# EasyEDA schematic SCH_LED-CIRCUIT_2025-07-21.json
TITLE: Sheet_1; REV: 1.0; Date: 2025-07-01; Sheet: 1/1; Drawn By: mirriamatim23; Company: Your Company
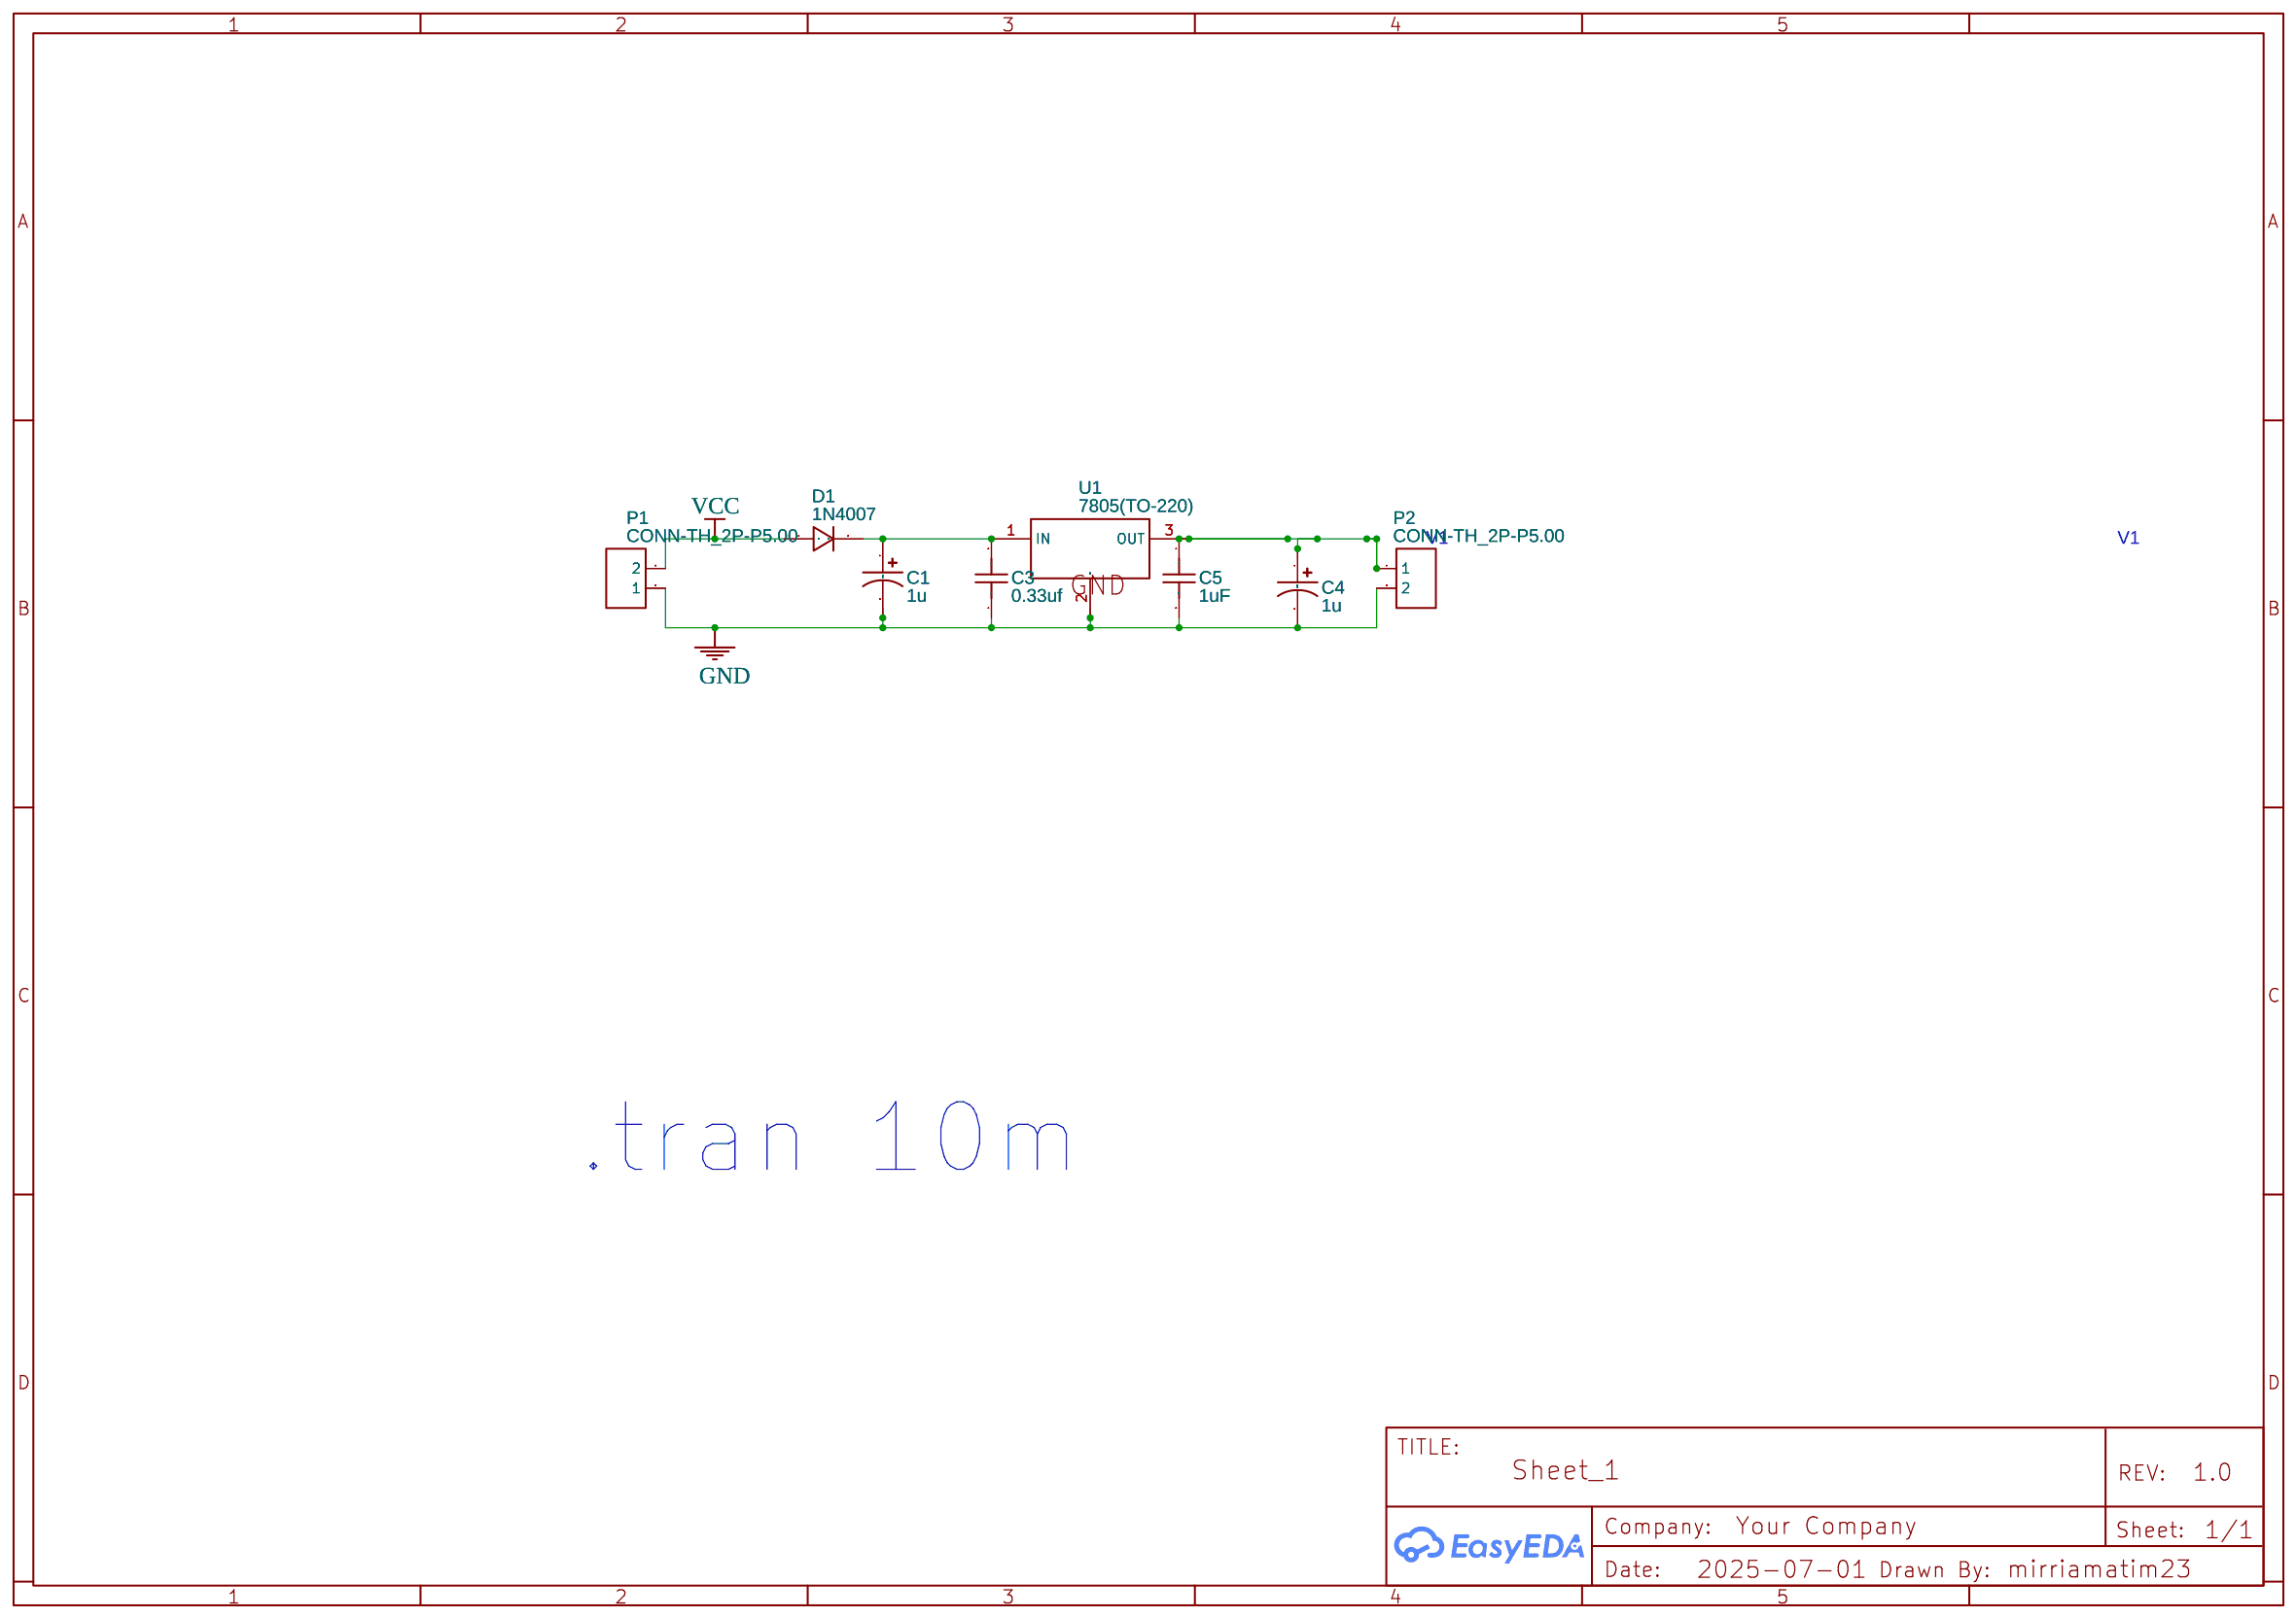
[diagram p0: schematic sheet]

## Parts
C1  1u  [CAP-D3.0×F1.5]
C3  0.33uf  [RAD-0.1]
C4  1u  [CAP-D3.0×F1.5]
C5  1uF  [RAD-0.1]
D1  1N4007  [DO-41_BD2.4-L4.7-P8.70-D0.9-RD]
P1  CONN-TH_2P-P5.00  [CONN-TH_2P-P5.00]
P2  CONN-TH_2P-P5.00  [CONN-TH_2P-P5.00]
U1  7805(TO-220)  [TO-220-3_L10.0-W4.5-P2.54-L]

## Library data of the parts
C1 C4 = CE_TH_D3.0×F1.5_US: Contributor: LCEDA_Lib
C3 C5 = C_RAD-0.1_US: Contributor: LCEDA_Lib
D1 = 1N4007: Supplier: LCSC; Manufacturer: SEMTECH; Supplier Part: C106903; Contributor: LCEDA_Lib
P1 P2 = CONN-TH_2P-P5.00: Supplier: LCSC; Contributor: LCEDA_Lib
U1 = 7805(TO-220): Supplier: LCSC; Manufacturer: STMicroelectronics; Manufacturer Part: L7805CV-DG; Supplier Part: C3795; Contributor: LCEDA_Lib

## Nets
GND: C1.2 C3.1 C4.2 C5.2 P1.1 P2.2 U1.2(GND)
VCC: D1.2 P1.2
Net-(C1-1): C1.1 C3.2 D1.1 U1.1(IN)
Net-(C4-1): C4.1 C5.1 P2.1 U1.3(OUT)

## Notes on the sheet
- V1
- V1
- .tran 10m
